# Altium schematic sheet Sheet1.SchDoc
size A; SheetNumber: 1; SheetTotal: 1
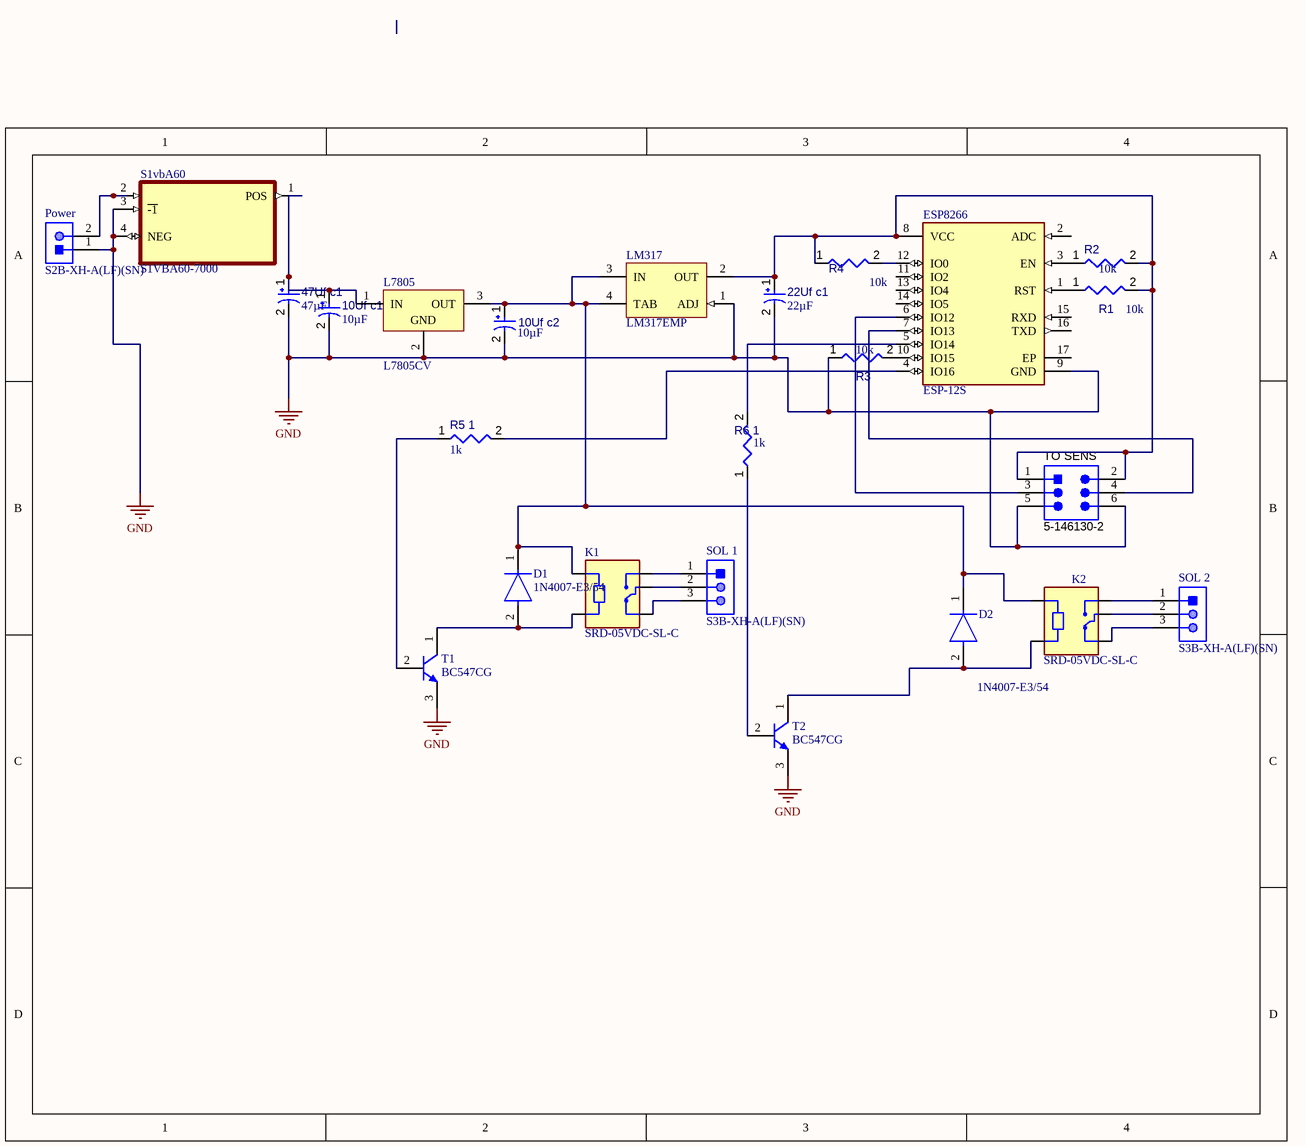
[diagram p0: Sheet1.SchDoc]

## Parts
10Uf_c1  value 10µF  [CAPPR55-200-1100X500X1200]  (hidden comment: ECA1HM100)
10Uf_c2  value 10µF  [CAPPR55-200-1100X500X1200]  (hidden comment: ECA1HM100)
22Uf_c1  value 22µF  [CAPPR55-200-1100X500X1200]  (hidden comment: ECA1HM220)
47Uf_c1  value 47µF  [CAPPR65-350-1150X800X1250]  (hidden comment: ECA-2AM470)
D1  1N4007-E3/54  [FP-1N4007-MFG]
D2  1N4007-E3/54  [FP-1N4007-MFG]
ESP8266  ESP-12S  [FP-ESP-12S-MFG]
K1  SRD-05VDC-SL-C  [RELAY_SRD-05VDC-SL-C]
K2  SRD-05VDC-SL-C  [RELAY_SRD-05VDC-SL-C]
L7805  L7805CV  [TO220]
LM317  LM317EMP  [DCY0004A_N]
Power  S2B-XH-A(LF)(SN)  [JST-S2B-XH-A(LF)(SN)_V]
R1  value 10k  [RESA60-630X240]  (hidden comment: MFR-25FBF52-10K)
R2  value 10k  [RESA60-630X240]  (hidden comment: MFR-25FBF52-10K)
R3  value 10k  [RESA60-630X240]  (hidden comment: MFR-25FBF52-10K)
R4  value 10k  [RESA60-630X240]  (hidden comment: MFR-25FBF52-10K)
R5_1  value 1k  [RESA60-630X240]  (hidden comment: MFR-25FBF52-1K)
R6_1  value 1k  [RESA60-630X240]  (hidden comment: MFR-25FBF52-1K)
S1vbA60  S1VBA60-7000  [DIOB_LL15XB60-7000]
SOL_1  S3B-XH-A(LF)(SN)  [JST-S3B-XH-A(LF)(SN)_V]
SOL_2  S3B-XH-A(LF)(SN)  [JST-S3B-XH-A(LF)(SN)_V]
T1  BC547CG  [ONSC-TO-92-3-29-11]
T2  BC547CG  [ONSC-TO-92-3-29-11]
TO_SENS  5-146130-2  [TECO-5-146130-2_V]

## Nets
GND: 10Uf_c1.2 10Uf_c2.2 22Uf_c1.2 47Uf_c1.2 ESP8266.9(GND) L7805.2(GND) LM317.1(ADJ) Power.1 R3.1 S1vbA60.3(~{-1}) S1vbA60.4(NEG) T1.3(E) T2.3(E) TO_SENS.5 TO_SENS.6
Net10Uf_c1_1: 10Uf_c1.1 47Uf_c1.1 L7805.1(IN) S1vbA60.1(POS)
Net10Uf_c2_1: 10Uf_c2.1 D1.1(C) D2.1(C) K1.A1 K2.A1 L7805.3(OUT) LM317.3(IN) LM317.4(TAB)
Net22Uf_c1_1: 22Uf_c1.1 ESP8266.8(VCC) LM317.2(OUT) R1.2 R2.2 R4.1 TO_SENS.1 TO_SENS.2
NetD1_2: D1.2(A) K1.A2 T1.1(C)
NetD2_2: D2.2(A) K2.A2 T2.1(C)
NetESP8266_1: ESP8266.1(RST) R1.1
NetESP8266_3: ESP8266.3(EN) R2.1
NetESP8266_4: ESP8266.4(IO16) R5_1.2
NetESP8266_5: ESP8266.5(IO14) R6_1.2
NetESP8266_6: ESP8266.6(IO12) TO_SENS.3
NetESP8266_7: ESP8266.7(IO13) TO_SENS.4
NetESP8266_10: ESP8266.10(IO15) R3.2
NetESP8266_12: ESP8266.12(IO0) R4.2
NetK1_COM: K1.COM SOL_1.2
NetK1_NC: K1.NC SOL_1.3
NetK1_NO: K1.NO SOL_1.1
NetK2_COM: K2.COM SOL_2.2
NetK2_NC: K2.NC SOL_2.3
NetK2_NO: K2.NO SOL_2.1
NetPower_2: Power.2 S1vbA60.2(\)
NetR5_1_1: R5_1.1 T1.2(B)
NetR6_1_1: R6_1.1 T2.2(B)

Not connected (* = marked no-connect by the designer): ESP8266 2(ADC) 11(IO2) 13(IO4) 14(IO5) 15(RXD) 16(TXD) 17(EP)

## Library data of the parts
10Uf_c1 10Uf_c2 = CMP-001-00025-7: Aluminum Electrolytic Capacitor, 10 uF, +/- 20%, 50 V, -40 to 85 degC, 2-Pin THD, RoHS, Bulk; Manufacturer: Panasonic; Ripple Current (AC): 65mA; Voltage Rating: 50V; Mounting Technology: TH; RoHS Compliant: True; Capacitor Type: Electrolytic; Datasheet Version: Rev. 05, 10/2016; Min Operating Temperature: -40°C; Packaging: Bulk; Ripple Current: 65mA; Tolerance: 20%; Max Operating Temperature: 85°C; Datasheet URL: https://industrial.panasonic.com/cdbs/www-data/pdf/RDF0000/ABA0000C1218.pdf; Lead Pitch: 2mm; Pins: 2; Diameter: 5mm; Manufacturer URL: http://www.panasonic.com/; Package Reference: CAPPR55-200-1100X500X1200; Package Description: 2-Pin Radial Lead, Dia 5 mm, Height 12 mm; Case/Package: Radial; Package Quantity: 200
22Uf_c1 = CMP-001-00027-7: Aluminum Electrolytic Capacitor, 22 uF, +/- 20%, 50 V, -40 to 85 degC, 2-Pin THD, RoHS, Bulk; Manufacturer: Panasonic; Ripple Current (AC): 100mA; Voltage Rating: 50V; Pins: 2; Case/Package: Radial; Datasheet Version: Rev. 05, 10/2016; RoHS Compliant: True; Max Operating Temperature: 85°C; Ripple Current: 100mA; Capacitor Type: Electrolytic; Mounting Technology: TH; Package Quantity: 200; Package Reference: CAPPR55-200-1100X500X1200; Package Description: 2-Pin Radial Lead, Dia 5 mm, Height 12 mm; Packaging: Bulk; Lead Pitch: 2mm; Min Operating Temperature: -40°C; Diameter: 5mm; Tolerance: 20%; Datasheet URL: https://industrial.panasonic.com/cdbs/www-data/pdf/RDF0000/ABA0000C1218.pdf; Manufacturer URL: http://www.panasonic.com/
47Uf_c1 = CMP-001-00036-7: Aluminum Electrolytic Capacitor, 47 uF, +/- 20%, 100 V, -40 to 85 degC, 2-Pin THD, RoHS, Bulk; Manufacturer: Panasonic; Ripple Current: 180mA; Voltage Rating: 100V; Max Operating Temperature: 85°C; Pins: 2; Case/Package: Radial; Packaging: Bulk; Capacitor Type: Electrolytic; Diameter: 8mm; RoHS Compliant: True; Package Reference: CAPPR65-350-1150X800X1250; Min Operating Temperature: -40°C; Mounting Technology: TH; Ripple Current (AC): 180mA; Datasheet Version: Mar-16; Lead Pitch: 3.5mm; Package Quantity: 200; Datasheet URL: http://industrial.panasonic.com/cdbs/www-data/pdf/RDF0000/ABA0000C1047.pdf; Package Description: 2-Pin Radial Lead, Dia 8 mm, Height 12.5 mm; Tolerance: 20%; Manufacturer URL: http://www.panasonic.com/
D1 D2 = CMP-02540-000046-1: DIODE GEN PURP 1KV 1A DO204AL; Manufacturer: Vishay; Value: 15pF; Max Junction Temp: +150°C; Max Surge Forward Current: 30A; Max Repetitive Reverse Voltage: 1000V; Peak Reverse Current: 30uA; Octopart: https://octopart.com/1n4007-e3%2F54-vishay-39548207; Digikey Description: DIODE GEN PURP 1KV 1A DO204AL; Category: Diode; Mouser Description: Rectifiers Vr/1000V Io/1A; Automotive: No; Package: 1N4007; Device Class L3: Rectifier Diodes; Temperature Range High: +150°C; Capacitance: 15pF; Ipc Land Pattern Name: DIOPA1088W105L520D270; Lead Free: Yes; ComponentLink2Description: Datasheet; Forward Current: 1A; Device Class L1: Discrete Semiconductors; ComponentLink2URL: http://www.vishay.com/docs/88503/1n4001.pdf; Temperature Range Low: -50°C; Height: 2.7mm; RoHS: TRUE; Temperature: -50°C to +150°C; Device Class L2: Diodes; Manufacturer Part Number: 1N4007-E3/54
ESP8266 = CMP-204316-000002-1: RX TXRX MOD WIFI PCB TRACE SMD; Interface: I2C; Sensitivity: -90dBm; Data Rate: 54Mbps; Frequency: 2.484GHz; Series: -
K1 K2 = CMP-012-000000-1: 5V Trigger Relay Module For Arduino And Raspberry Pi 5V Trigger Relay Module For Arduino And Raspberry Pi; MF: Songle Relay; SnapEDA_Link: https://www.snapeda.com/parts/SRD-05VDC-SL-C/Songle+Relay/view-part/?ref=snap; MP: SRD-05VDC-SL-C; Check_prices: https://www.snapeda.com/parts/SRD-05VDC-SL-C/Songle+Relay/view-part/?ref=eda; Source: SRD-05VDC-SL-C.SchLib; Value: *; Component Type: Standard; Package: NON STANDARD-5 Songle Relay; Availability: Not in stock; Price: None; Pin Count: 5; Design Item ID: SRD-05VDC-SL-C
L7805 = CMP-0244-00483-1: Positive Voltage Regulator, 5V, 3-Pin TO-220; PackageDescription: TO, Thru-Hole, Vertical, Heatsink Mounted; 3 In-Line Leads; Pitch 2.54 mm; ComponentLink2Description: Datasheet; PackageReference: TO220; ComponentLink3URL: http://www.st.com/internet/com/TECHNICAL_RESOURCES/TECHNICAL_LITERATURE/PACKAGE_INFORMATION/CD00004649.pdf; DatasheetVersion: 16/11/2011; ComponentLink1Description: Manufacturer URL; ComponentLink1URL: http://www.st.com; PackageVersion: ver3.0; ComponentLink3Description: Package Specification; ComponentLink2URL: http://www.st.com/internet/com/TECHNICAL_RESOURCES/TECHNICAL_LITERATURE/DATASHEET/CD00000444.pdf
LM317 = CMP-0062-01706-3: 3-Terminal Adjustable Regulator, 4-pin SOT-223; Manufacturer: Texas Instruments; PowerWise: N; PackageTopMarking: XYTT*N01A; CompType: LDO IC; Code_JEDEC: TO-261-AA; Code_IPC: SOT223-4; PackageReference: DCY0004A; PackageDescription: Molded SOT-223, 6.50 x 3.56 x 1.6mm Body, 4 Lead, 2.3mm Pitch; ComponentLink1Description: Datasheet URL; PinCount: 4; RoHS: N; ComponentLink1URL: http://www.ti.com/general/docs/lit/getliterature.tsp?genericPartNumber=LM317-N&fileType=pdf
Power = CMP-002-00032-2: Male Header, Pitch 2.5 mm, 1 x 2 Position, Height 6.1 mm, Tail Length 3.4 mm, -25 to 85 degC, RoHS, Bulk; Manufacturer: JST; Case/Package: S2B-XH-A(LF)(SN); Package Description: XH Series Disconnectable Crimp Style Connector, Pitch 2.5 mm, 1 x 2 Position, Height 6.1 mm, Tail Length 3.4 mm; Manufacturer URL: http://www.jst.com/home2.html; Datasheet URL: http://www.jst-mfg.com/product/pdf/eng/eXH.pdf; Connector Type: Header; Package Reference: S2B-XH-A(LF)(SN); Mounting Technology: TH; Max Operating Temperature: 85°C; Min Operating Temperature: -25°C; Datasheet Version: May-16; Gender: Male; RoHS Compliant: Unknown
R1-R4 = CMP-009-00047-4: Axial Resistor, 10 KOhm, +/- 1%, 0.25 W, -55 to 155 degC, 2-Pin THD, RoHS, Bulk; Manufacturer: Yageo; Power: 250mW; Voltage Rating: 250V; Manufacturer URL: http://www.yageo.com/; Datasheet URL: http://www.yageo.com/documents/recent/Yageo%20LR_MFR_2013.pdf; Package Reference: MFR-25; Min Operating Temperature: -55°C; Mounting Technology: TH; Package Quantity: 200; Case/Package: Axial; Tolerance: 1%; RoHS Compliant: True; Datasheet Version: Apr-13; Packaging: Bulk; Max Operating Temperature: 155°C; Package Description: 2-Pin Axial Lead, Dia 2.4 mm, Body Length 6.3 mm
R5_1 R6_1 = CMP-009-00048-4: Axial Resistor, 1 KOhm, +/- 1%, 250 mW, -55 to 155 degC, 2-Pin THD, RoHS, Bulk; Manufacturer: Yageo; Voltage Rating: 250V; Power: 250mW; Min Operating Temperature: -55°C; Max Operating Temperature: 155°C; Tolerance: 1%; Package Reference: MFR-25; Composition: CarbonFilm; Mounting Technology: TH; Packaging: Bulk; Case/Package: Axial; Datasheet URL: http://www.yageo.com/documents/recent/Yageo%20LR_MFR_2013.pdf; Package Quantity: 200; Manufacturer URL: http://www.yageo.com/; Package Description: 2-Pin Axial Lead, Dia 2.4 mm, Body Length 6.3 mm; Datasheet Version: Apr-13; RoHS Compliant: True
S1vbA60 = S1VBA60-7000: 1 IO, 600 VRM, 700 VRSM, THD Bridge Diode, 1V Package Type; MF: Shindengen; Package: SIP-4 Shindengen; Price: None; Value: *; SnapEDA_Link: https://www.snapeda.com/parts/S1VBA60-7000/Shindengen/view-part/?ref=snap; MP: S1VBA60-7000; Availability: In Stock; Check_prices: https://www.snapeda.com/parts/S1VBA60-7000/Shindengen/view-part/?ref=eda
SOL_1 SOL_2 = CMP-002-00033-2: Male Header, Pitch 2.5 mm, 1 x 3 Position, Height 6.1 mm, Tail Length 3.4 mm, -25 to 85 degC, RoHS, Bulk; Manufacturer: JST; Package Description: Male Header, Pitch 2.5 mm, 1 x 3 Position, Height 6.1 mm, Tail Length 3.4 mm; Manufacturer URL: http://www.jst.com/home2.html; Datasheet URL: http://www.jst-mfg.com/product/pdf/eng/eXH.pdf; RoHS Compliant: Unknown; Connector Type: Header; Package Reference: S3B-XH-A(LF)(SN); Gender: Male; Case/Package: S3B-XH-A(LF)(SN); Mounting Technology: TH; Max Operating Temperature: 85°C; Min Operating Temperature: -25°C; Datasheet Version: May-16
T1 T2 = CMP-1048-01464-1: Amplifier Transistor, NPN Silicon, 3-Pin TO-92, Pb-Free, Bulk Box; Manufacturer: On Semiconductor; IC Continuous (A): 0.1; fT Min (MHz): 150; ComponentLink3URL: http://www.onsemi.cn/pub_link/Collateral/2N6426-D.PDF; Mounting Technology: Through Hole; PackageReference: TO-92-3-29-11_AM_SL; ComponentLink2Description: Datasheet; RoHS: TRUE; Packing: Bulk Box; ComponentLink1Description: Manufacturer URL; PackageDescription: 3-Pin Transistor Outline, Body 4.825 x 3.685 mm, Pitch 1.27 mm; PackageVersion: Rev. AM; ComponentLink2URL: http://www.onsemi.com/pub_link/Collateral/BC546-D.PDF; ComponentLink3Description: Package Specification; ComponentLink1URL: http://www.onsemi.com/; DatasheetVersion: Rev. 7; Polarity: NPN; PartNumber: BC547CG
TO_SENS = CMP-002-00018-2: Male Header, Pitch 2.54 mm, 2 x 3 Position, Height 8.13 mm, -65 to 125 degC, RoHS, Tube; Manufacturer: TE Connectivity; Max Operating Temperature: 125°C; Datasheet Version: Oct-15; Package Description: Male Header, Pitch 2.54 mm, 2 x 3 Position, Height 8.13 mm; Case/Package: 5-146130-2; Datasheet URL: http://www.te.com/commerce/DocumentDelivery/DDEController?Action=showdoc&DocId=Customer+Drawing%7F146130%7FM%7Fpdf%7FEnglish%7FENG_CD_146130_M.pdf%7F5-146130-2; Manufacturer URL: http://www.te.com/; Connector Type: Header; Gender: Male; Mounting Technology: SM; Min Operating Temperature: -65°C; RoHS Compliant: Unknown; Package Reference: 5-146130-2